# EAGLE design bblab (EAGLE 5.07)
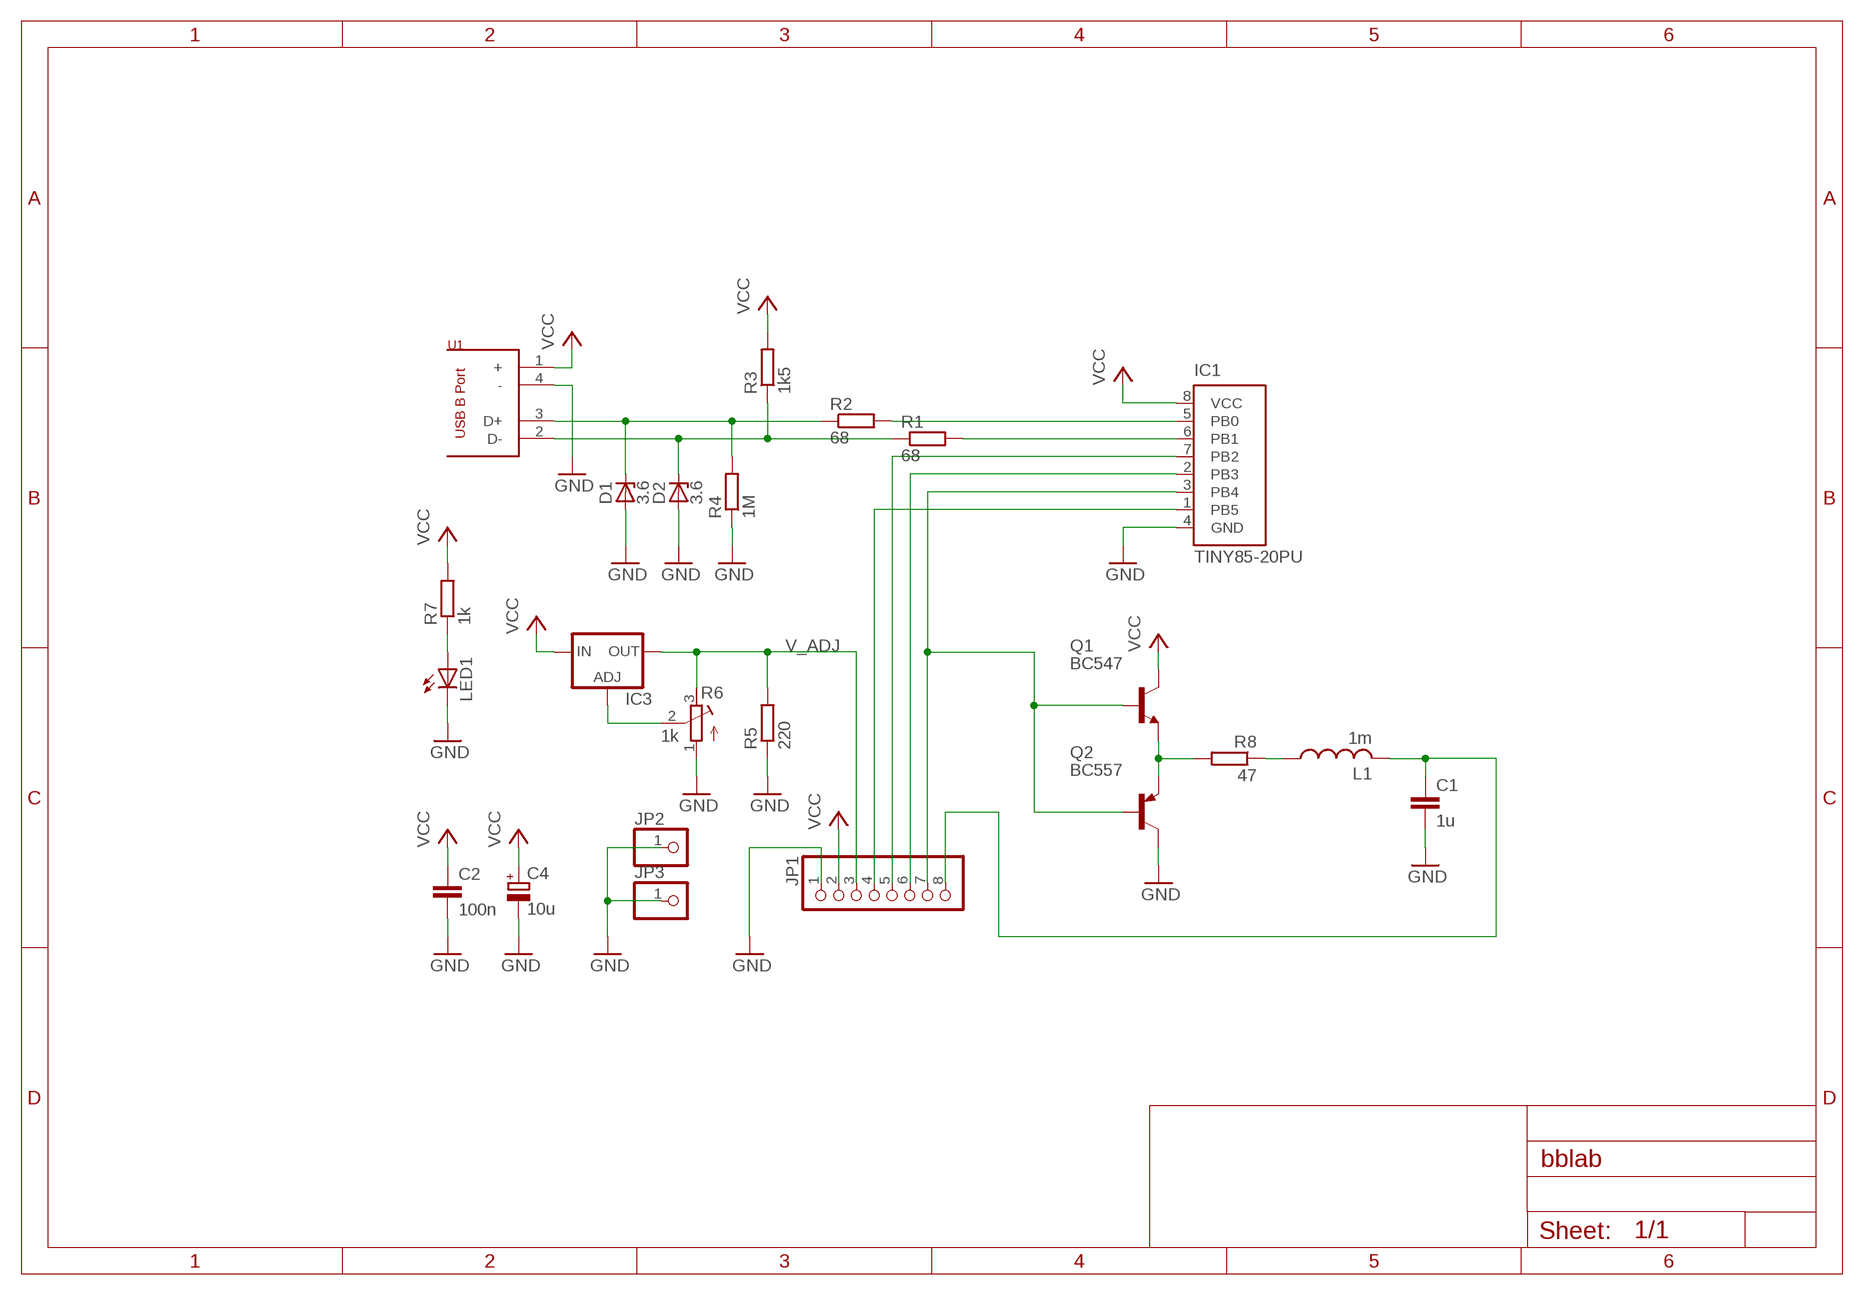
[diagram p0: schematic, sheet 1]

## Parts
C1  1u  C-EU050-025X075  [C050-025X075]
C2  100n  C-EU050-025X075  [C050-025X075]
C4  10u  CPOL-EUE2-5  [E2-5]
D1  3.6  ZENER-DIODEZD-5  [ZDIO-5]
D2  3.6  ZENER-DIODEZD-5  [ZDIO-5]
IC1  TINY85-20PU  [DIL08]
IC3  LM317TL  [317TL]
JP1  PINHD-1X8/90  [1X08/90]
JP2  PINHD-1X1  [1X01]
JP3  PINHD-1X1  [1X01]
L1  1m  L-US0207/10  [0207/10]
LED1  LED5MM  [LED5MM]
Q1  BC547  [TO92]
Q2  BC557  [TO92]
R1  68  R-EU_0204/7  [0204/7]
R2  68  R-EU_0204/7  [0204/7]
R3  1k5  R-EU_0204/7  [0204/7]
R4  1M  R-EU_0204/7  [0204/7]
R5  220  R-EU_0204/7  [0204/7]
R6  1k  R-TRIMM64P  [RTRIM64P]
R7  1k  R-EU_0204/7  [0204/7]
R8  47  R-EU_0204/7  [0204/7]
U1  USB_B  [USB_B]

## Nets
GND [pwr]: C1.2 C2.2 C4.- D1.A D2.A IC1.4(GND) JP1.1 JP2.1 JP3.1 LED1.K(C) Q2.3(C) R4.1 R5.1 R6.1(E) U1.4(-)
N$1: D1.C R2.1 R4.2 U1.3(D+)
N$2: D2.C R1.1 R3.1 U1.2(D-)
N$3: IC1.5(PB0) R2.2
N$4: IC1.6(PB1) R1.2
N$5: C1.1 JP1.8 L1.2
N$6: Q1.1(E) Q2.1(E) R8.2
N$7: L1.1 R8.1
N$8: IC1.1(PB5) JP1.4
N$9: IC1.7(PB2) JP1.5
N$10: IC1.3(PB4) JP1.7 Q1.2(B) Q2.2(B)
N$11: IC1.2(PB3) JP1.6
N$12: LED1.A R7.1
N$13: IC3.1(ADJ) R6.2(S)
V_ADJ [pwr]: IC3.2(OUT) JP1.3 R5.2 R6.3(A)
VCC [pwr]: C2.1 C4.+ IC1.8(VCC) IC3.3(IN) JP1.2 Q1.3(C) R3.2 R7.2 U1.1(+)

## Library data of the parts
C1 C2 = resistor:C-EU: CAPACITOR, European symbol
C4 = resistor:CPOL-EU: POLARIZED CAPACITOR, European symbol
D1 D2 = diode:ZENER-DIODE: Z-Diode
IC1 = library:TINY85: 8-bit AVR Microcontroller with 1K Bytes In-System Programmable Flash Source: http://www.atmel.com/dyn/resources/prod_documents/2535S.pdf
IC3 = v-reg:LM317TL: VOLTAGE REGULATOR
JP1 = pinhead:PINHD-1X8: PIN HEADER
JP2 JP3 = pinhead:PINHD-1X1: PIN HEADER
L1 = resistor:L-US: INDUCTOR, American symbol
LED1 = led:LED: LED OSRAM: - CHIPLED LG R971, LG N971, LY N971, LG Q971, LY Q971, LO R971, LY R971 LH N974, LH R974 LS Q976, LO Q976, LY Q976 LO Q996 - Hyper CHIPLED LW Q18S LB Q993, LB Q99A, LB R99A - SideLED LS A670, LO A670, LY A670, LG A670, LP A670 LB A673, LV A673, LT A673, LW A673 LH A674 LY A675 LS A676, LA A676, LO A676, LY A676, LW A676 LS A679, LY A679, LG A679 - Hyper Micro SIDELED® LS Y876, LA Y876, LO Y876, LY Y876 LT Y87S - SmartLED LW L88C, LW L88S LB L89C, LB L89S, LG L890 LS L89K, LO L89K, LY L89K LS L896, LA L896, LO L896, LY L896 - TOPLED LS T670, LO T670, LY T670, LG T670, LP T670 LSG T670, LSP T670, LSY T670, LOP T670, LYG T670 LG T671, LOG T671, LSG T671 LB T673, LV T673, LT T673, LW T673 LH T674 LS T676, LA T676, LO T676, LY T676, LB T676, LH T676, LSB T676, LW T676 LB T67C, LV T67C, LT T67C, LS T67K, LO T67K, LY T67K, LW E67C LS E67B, LA E67B, LO E67B, LY E67B, LB E67C, LV E67C, LT E67C LW T67C LS T679, LY T679, LG T679 LS T770, LO T770, LY T770, LG T770, LP T770 LB T773, LV T773, LT T773, LW T773 LH T774 LS E675, LA E675, LY E675, LS T675 LS T776, LA T776, LO T776, LY T776, LB T776 LHGB T686 LT T68C, LB T68C - Hyper Mini TOPLED® LB M676 - Mini TOPLED Santana® LG M470 LS M47K, LO M47K, LY M47K Source: http://www.osram.convergy.de LUXEON: - LUMILED® LXK2-PW12-R00, LXK2-PW12-S00, LXK2-PW14-U00, LXK2-PW14-V00 LXK2-PM12-R00, LXK2-PM12-S00, LXK2-PM14-U00 LXK2-PE12-Q00, LXK2-PE12-R00, LXK2-PE12-S00, LXK2-PE14-T00, LXK2-PE14-U00 LXK2-PB12-K00, LXK2-PB12-L00, LXK2-PB12-M00, LXK2-PB14-N00, LXK2-PB14-P00, LXK2-PB14-Q00 LXK2-PR12-L00, LXK2-PR12-M00, LXK2-PR14-Q00, LXK2-PR14-R00 LXK2-PD12-Q00, LXK2-PD12-R00, LXK2-PD12-S00 LXK2-PH12-R00, LXK2-PH12-S00 LXK2-PL12-P00, LXK2-PL12-Q00, LXK2-PL12-R00 Source: www.luxeon.com KINGBRIGHT: KA-3528ASYC Source: www.kingbright.com
Q1 = transistor-npn:BC547*: NPN Transistor
Q2 = transistor-pnp:BC557: PNP Transistor
R1-R5 R7 R8 = resistor:R-EU_: RESISTOR, European symbol
R6 = resistor:R-TRIMM: Trimm resistor
U1 = library:USB_B

## Net classes
1 pwr: width 0.508 mm

## Board
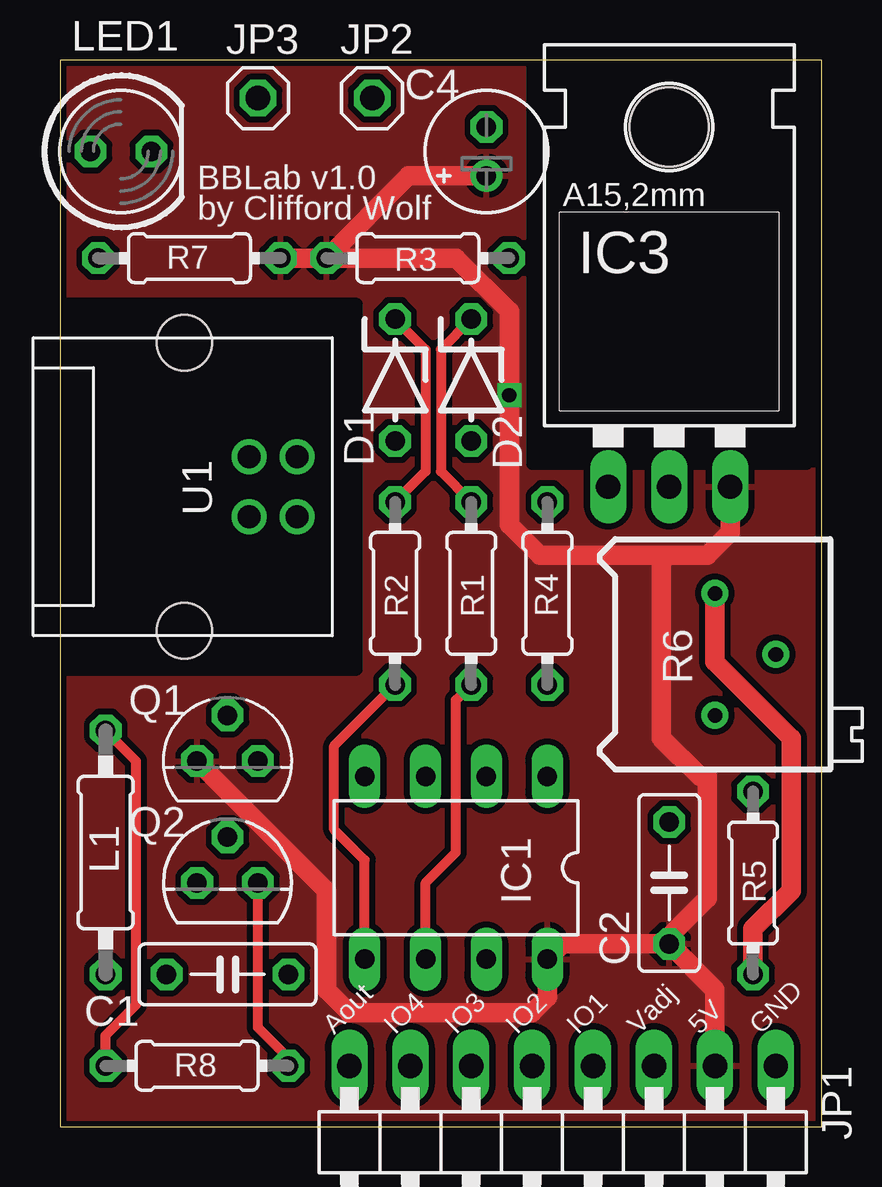
[diagram p1: board, top side]
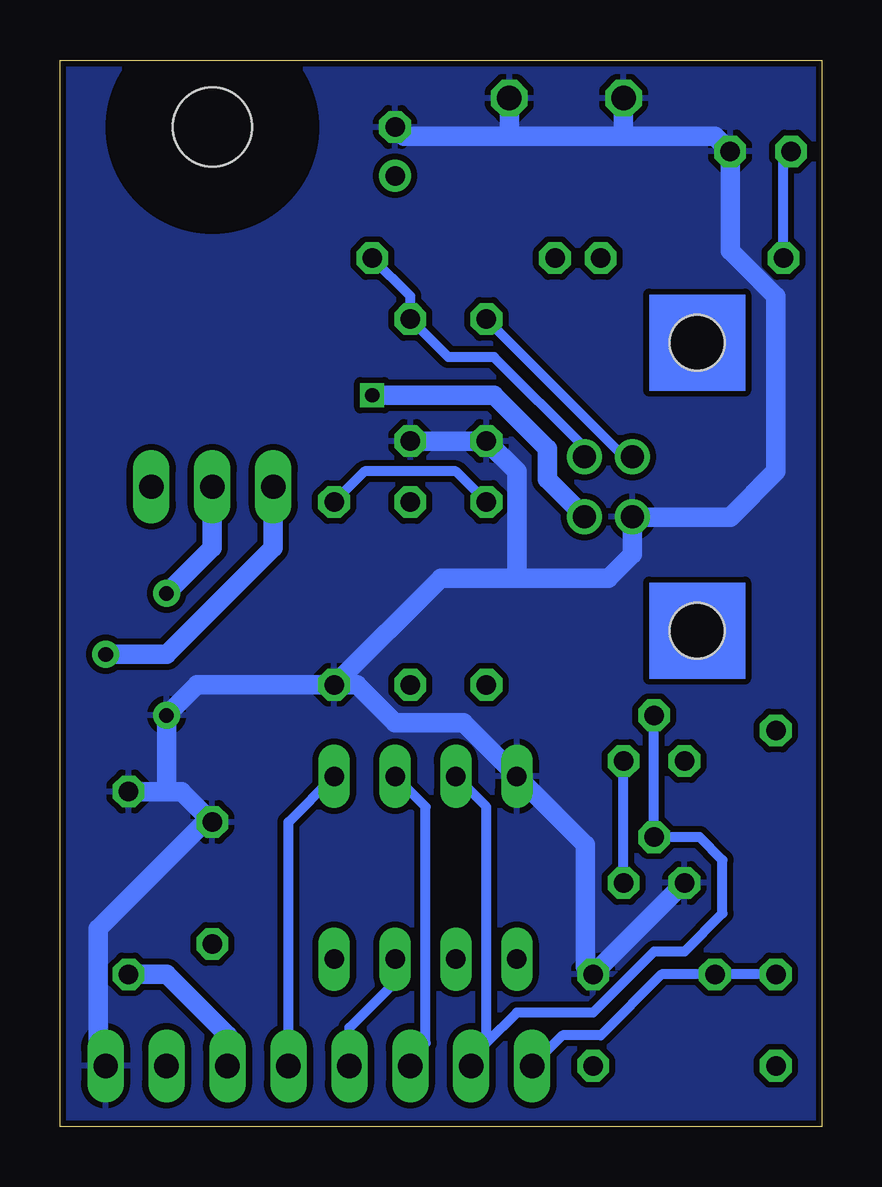
[diagram p2: board, bottom side, seen from below]

Size 31.75 x 44.45 mm. Coordinates in mm from the lower left corner, seen from the top.
Outline: 0,0 31.75,0 31.75,44.45 0,44.45 0,0
Copper layers (1*16): Top 0.035mm / dielectric 1.5mm / Bottom 0.035mm
Design rules "default *": minimum track width 10mil, minimum drill 24mil, track to track 8mil, track to pad 8mil, pad to pad 8mil, via to via 8mil, smd to smd 8mil, copper to edge 10mil, drill to drill 8mil, minimum pad ring 10mil, minimum via ring 8mil, stop-mask expansion 4mil, vias tented up to drill 0mil, thermal gap 10mil
tRestrict: area 19.7,27.6 to 31.1,45.4; area -2.9,19.1 to 12.4,34.3

### Footprints (pad centres in the part's own frame; a part is rotated, then mirrored left to right if it is on the bottom)
C050-025X075 = drill 0.813 octagon: 1 -2.54,0; 2 2.54,0
E2-5 = drill 0.813 pad 1.27 round: + -1.016,0 | drill 0.813 pad 1.27 octagon: - 1.016,0
ZDIO-5 = drill 0.813 octagon: A 2.54,0; C -2.54,0
DIL08 = drill 0.813 long: 1 -3.81,-3.81; 2 -1.27,-3.81; 3 1.27,-3.81; 4 3.81,-3.81; 5 3.81,3.81; 6 1.27,3.81; 7 -1.27,3.81; 8 -3.81,3.81
317TL = drill 1.016 long: 1 -2.54,-3.81; 2 0,-3.81; 3 2.54,-3.81 | hole 3.302: 0,11.176
1X08/90 = drill 1.016 long: 1 -8.89,-3.81; 2 -6.35,-3.81; 3 -3.81,-3.81; 4 -1.27,-3.81; 5 1.27,-3.81; 6 3.81,-3.81; 7 6.35,-3.81; 8 8.89,-3.81
1X01 = drill 1.016 octagon: 1 0,0
0207/10 = drill 0.813 octagon: 1 -5.08,0; 2 5.08,0
LED5MM = drill 0.813 octagon: A -1.27,0; K 1.27,0
TO92 = drill 0.813 octagon: 1 1.27,0; 2 0,1.905; 3 -1.27,0
0204/7 = drill 0.813 octagon: 1 -3.81,0; 2 3.81,0
RTRIM64P = drill 0.61 round: 1 0,-2.54; 2 2.54,0; 3 0,2.54
USB_B = drill 0.95 round: 1 1.25,1; 2 -1.25,1; 3 -1.25,-1; 4 1.25,-1 | hole 2.3: -6,-3.71; 6,-3.71

### Placement (x,y rotation side)
C1  6.99,6.35 0 top
C2  25.4,10.16 90 top
C4  17.78,40.64 90 top
D1  13.97,31.11 270 top
D2  17.14,31.11 270 top
IC1  16.51,10.79 180 top
IC3  25.4,30.48 0 top
JP1  20.95,-1.27 180 top
JP2  13.02,42.86 0 top
JP3  8.26,42.86 0 top
L1  1.91,11.43 270 top
LED1  2.54,40.64 0 top
Q1  6.99,15.24 0 top
Q2  6.99,10.16 0 top
R1  17.14,22.23 270 top
R2  13.97,22.23 270 top
R3  14.92,36.2 180 top
R4  20.32,22.23 90 top
R5  28.89,10.16 270 top
R6  27.3,19.68 0 top
R7  5.4,36.2 0 top
R8  5.71,2.54 0 top
U1  8.89,26.67 270 top

### Tracks (layer width: path | path; a pad name or v marks a point on that pad's centre or on a via)
GND
  Bottom 0.813: 8.26,41.27 4.45,41.27 LED1.K 3.81,36.51 1.91,34.61 1.91,27.3 3.81,25.4 7.87,25.4 U1.4 7.89,23.86 8.89,22.86 12.7,22.86 | 8.26,41.27 13.02,41.27 | 13.02,41.27 17.4,41.27 C4.- | R4.1 15.88,22.86 12.7,22.86 | D2.A D1.A 12.7,27.3 12.7,22.86 | R4.1 26.04,18.41 R6.1 27.3,13.97 | 27.3,13.97 R5.1 | 27.3,13.97 26.67,13.97 C2.2 25.72,12.7 30.16,8.26 30.16,2.86 JP1.1 | R4.1 19.37,18.41 17.78,16.83 14.92,16.83 IC1.4 9.84,11.75 9.84,6.67 C1.2 Q2.3 | 8.26,41.27 JP3.1 | 13.02,41.27 JP2.1
  pour Bottom (isolate 0.254): 0,44.45 0,0 31.75,0 31.75,44.45
N$1
  Top 0.406: D1.C 15.24,32.38 15.24,27.3 R2.1
  Bottom 0.406: U1.3 8.23,27.92 D1.C | R4.2 19.05,27.3 15.24,27.3 R2.1
N$2
  Top 0.406: R1.1 15.88,27.3 15.88,32.38 D2.C
  Bottom 0.406: U1.2 9.89,28.3 13.65,32.07 15.56,32.07 D2.C 17.14,34.61 R3.1
N$3
  Top 0.406: IC1.5 12.7,11.11 11.43,12.38 11.43,15.88 R2.2
N$4
  Top 0.406: IC1.6 15.24,10.16 16.51,11.43 16.51,17.78 R1.2
N$5
  Bottom 0.406: L1.2 C1.1 6.67,6.35 9.21,3.81 10.79,3.81 JP1.8
N$6
  Top 0.406: R8.2 9.53,2.86 8.26,4.13 Q2.1
  Bottom 0.406: Q2.1 Q1.1
N$7
  Top 0.406: R8.1 1.91,3.81 3.17,5.08 3.17,15.24 L1.1
N$8
  Bottom 0.406: JP1.4 22.23,12.7 IC1.1
N$9
  Bottom 0.406: JP1.5 19.68,4.13 17.78,6.03 IC1.7
N$10
  Bottom 0.406: 13.97,3.49 14.61,2.86 JP1.7 | 13.97,3.49 13.97,13.34 IC1.3 | Q1.2 Q2.2 5.08,12.06 4.13,11.11 4.13,8.89 5.71,7.3 6.99,7.3 9.53,4.76 12.7,4.76 13.97,3.49
N$11
  Bottom 0.406: JP1.6 17.14,2.86 16.51,3.49 16.51,13.34 IC1.2
N$12
  Bottom 0.406: R7.1 1.59,40.32 LED1.A
N$13
  Bottom 0.813: R6.2 27.3,19.68 22.86,24.13 IC3.1
V_ADJ
  Top 0.813: R5.2 28.89,8.26 30.48,9.84 30.48,16.19 27.3,19.37 R6.3
  Bottom 0.813: IC3.2 25.4,24.13 R6.3 | R5.2 27.3,6.35 24.77,3.81 JP1.3
VCC  (via drill 0.6 pad 0.81)
  Top 0.813: C4.+ 14.54,39.62 R3.2 | R3.2 R7.2 | R3.2 16.51,36.2 18.73,33.97 v18.73,30.48 18.73,25.08 20,23.81 25.08,23.81 | 25.08,23.81 26.99,23.81 27.94,24.77 IC3.3 | JP1.2 27.3,5.71 C2.1 | C2.1 20.95,7.62 IC1.8 20.32,5.4 19.68,4.76 12.06,4.76 11.11,5.71 11.11,9.84 Q1.3 | C2.1 25.4,7.94 26.99,9.53 26.99,14.61 26.67,14.61 25.08,16.19 25.08,23.81
  Bottom 0.813: U1.1 9.86,25.42 11.43,26.99 11.43,28.26 13.65,30.48 v18.73,30.48
  pour Top (isolate 0.254): 0,44.45 0,0 31.75,0 31.75,44.45

### Text on the board
tPlace: BBLab v1.0 | by Clifford Wolf | Aout | IO4 | IO3 | IO2 | IO1 | Vadj | 5V | GND